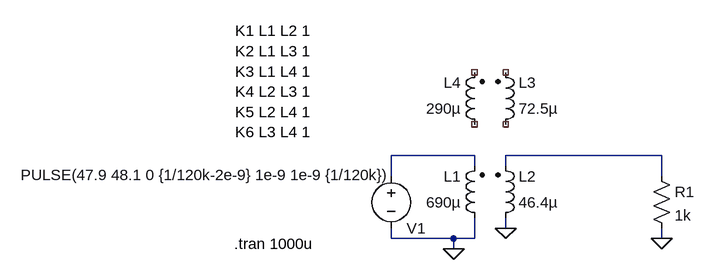
[diagram p0: schematic Draft1.asc]
Draft1.asc, the LTspice schematic file:
Version 4
SHEET 1 880 680
WIRE -64 240 -192 240
WIRE 224 240 -16 240
WIRE -64 256 -64 240
WIRE -16 256 -16 240
WIRE -192 272 -192 240
WIRE 224 272 224 240
WIRE -16 352 -16 336
WIRE -192 368 -192 352
WIRE -96 368 -192 368
WIRE -64 368 -64 336
WIRE -64 368 -96 368
WIRE 224 368 224 352
WIRE -96 384 -96 368
FLAG -16 352 0
FLAG -96 384 0
FLAG 224 368 0
SYMBOL ind2 -48 352 R180
WINDOW 0 36 80 Left 2
WINDOW 3 36 40 Left 2
SYMATTR InstName L1
SYMATTR Value 690µ
SYMATTR Type ind
SYMATTR SpiceLine Rser=13m
SYMBOL ind2 -32 352 M180
WINDOW 0 36 80 Left 2
WINDOW 3 36 40 Left 2
SYMATTR InstName L2
SYMATTR Value 46.4µ
SYMATTR Type ind
SYMATTR SpiceLine Rser=7m
SYMBOL ind2 -32 208 M180
WINDOW 0 36 80 Left 2
WINDOW 3 36 40 Left 2
SYMATTR InstName L3
SYMATTR Value 72.5µ
SYMATTR Type ind
SYMATTR SpiceLine Rser=10m
SYMBOL ind2 -48 208 R180
WINDOW 0 36 80 Left 2
WINDOW 3 36 40 Left 2
SYMATTR InstName L4
SYMATTR Value 290µ
SYMATTR Type ind
SYMATTR SpiceLine Rser=16m
SYMBOL voltage -192 256 R0
WINDOW 0 24 96 Left 2
WINDOW 3 -570 14 Left 2
WINDOW 123 0 0 Left 0
WINDOW 39 0 0 Left 0
SYMATTR InstName V1
SYMATTR Value PULSE(47.9 48.1 0 {1/120k-2e-9} 1e-9 1e-9 {1/120k})
SYMBOL res 208 256 R0
SYMATTR InstName R1
SYMATTR Value 1k
TEXT -432 48 Left 2 !K1 L1 L2 1\nK2 L1 L3 1\nK3 L1 L4 1\nK4 L2 L3 1\nK5 L2 L4 1\nK6 L3 L4 1
TEXT -434 376 Left 2 !.tran 1000u

The netlist it stands for:
* Draft1.asc
L1 0 N001 690µ Rser=13m
L2 0 N002 46.4µ Rser=7m
L3 NC_01 NC_02 72.5µ Rser=10m
L4 NC_03 NC_04 290µ Rser=16m
V1 N001 0 PULSE(47.9 48.1 0 {1/120k-2e-9} 1e-9 1e-9 {1/120k})
R1 N002 0 1k
K1 L1 L2 1
K2 L1 L3 1
K3 L1 L4 1
K4 L2 L3 1
K5 L2 L4 1
K6 L3 L4 1
.tran 1000u
.backanno
.end